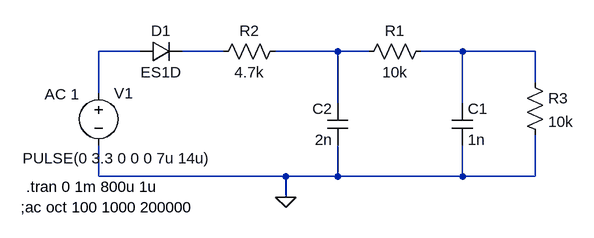
[diagram p0: schematic filter2.asc]
filter2.asc, the LTspice schematic file:
Version 4
SHEET 1 880 680
WIRE -48 64 -112 64
WIRE 80 64 16 64
WIRE 256 64 160 64
WIRE 304 64 256 64
WIRE 448 64 384 64
WIRE 560 64 448 64
WIRE 560 112 560 64
WIRE -112 128 -112 64
WIRE 256 144 256 64
WIRE 448 144 448 64
WIRE -112 256 -112 208
WIRE 176 256 -112 256
WIRE 256 256 256 208
WIRE 256 256 176 256
WIRE 448 256 448 208
WIRE 448 256 256 256
WIRE 560 256 560 192
WIRE 560 256 448 256
WIRE 176 288 176 256
FLAG 176 288 0
SYMBOL voltage -112 112 R0
WINDOW 3 -117 116 Left 2
WINDOW 123 -83 18 Left 2
WINDOW 39 0 0 Left 2
SYMATTR Value PULSE(0 3.3 0 0 0 7u 14u)
SYMATTR Value2 AC 1
SYMATTR InstName V1
SYMBOL res 400 48 R90
WINDOW 0 0 56 VBottom 2
WINDOW 3 32 56 VTop 2
SYMATTR InstName R1
SYMATTR Value 10k
SYMBOL res 176 48 R90
WINDOW 0 0 56 VBottom 2
WINDOW 3 32 56 VTop 2
SYMATTR InstName R2
SYMATTR Value 4.7k
SYMBOL cap 432 144 R0
SYMATTR InstName C1
SYMATTR Value 1n
SYMBOL cap 272 208 R180
WINDOW 0 24 56 Left 2
WINDOW 3 24 8 Left 2
SYMATTR InstName C2
SYMATTR Value 2n
SYMBOL diode -48 80 R270
WINDOW 0 32 32 VTop 2
WINDOW 3 0 32 VBottom 2
SYMATTR InstName D1
SYMATTR Value ES1D
SYMBOL res 544 96 R0
SYMATTR InstName R3
SYMATTR Value 10k
TEXT -232 304 Left 2 !;ac oct 100 1000 200000
TEXT -224 272 Left 2 !.tran 0 1m 800u 1u

The netlist it stands for:
* filter2.asc
V1 N001 0 PULSE(0 3.3 0 0 0 7u 14u) AC 1
R1 N004 N003 10k
R2 N003 N002 4.7k
C1 N004 0 1n
C2 0 N003 2n
D1 N001 N002 ES1D
R3 N004 0 10k
.model D D
.lib standard.dio
;ac oct 100 1000 200000
.tran 0 1m 800u 1u
.backanno
.end